# Altium schematic sheet MCU_block.SchDoc
size 420 x 297 mm; DocumentNumber: ЛАЭ3.20.10.02.05.200 Э3; SheetNumber: 2
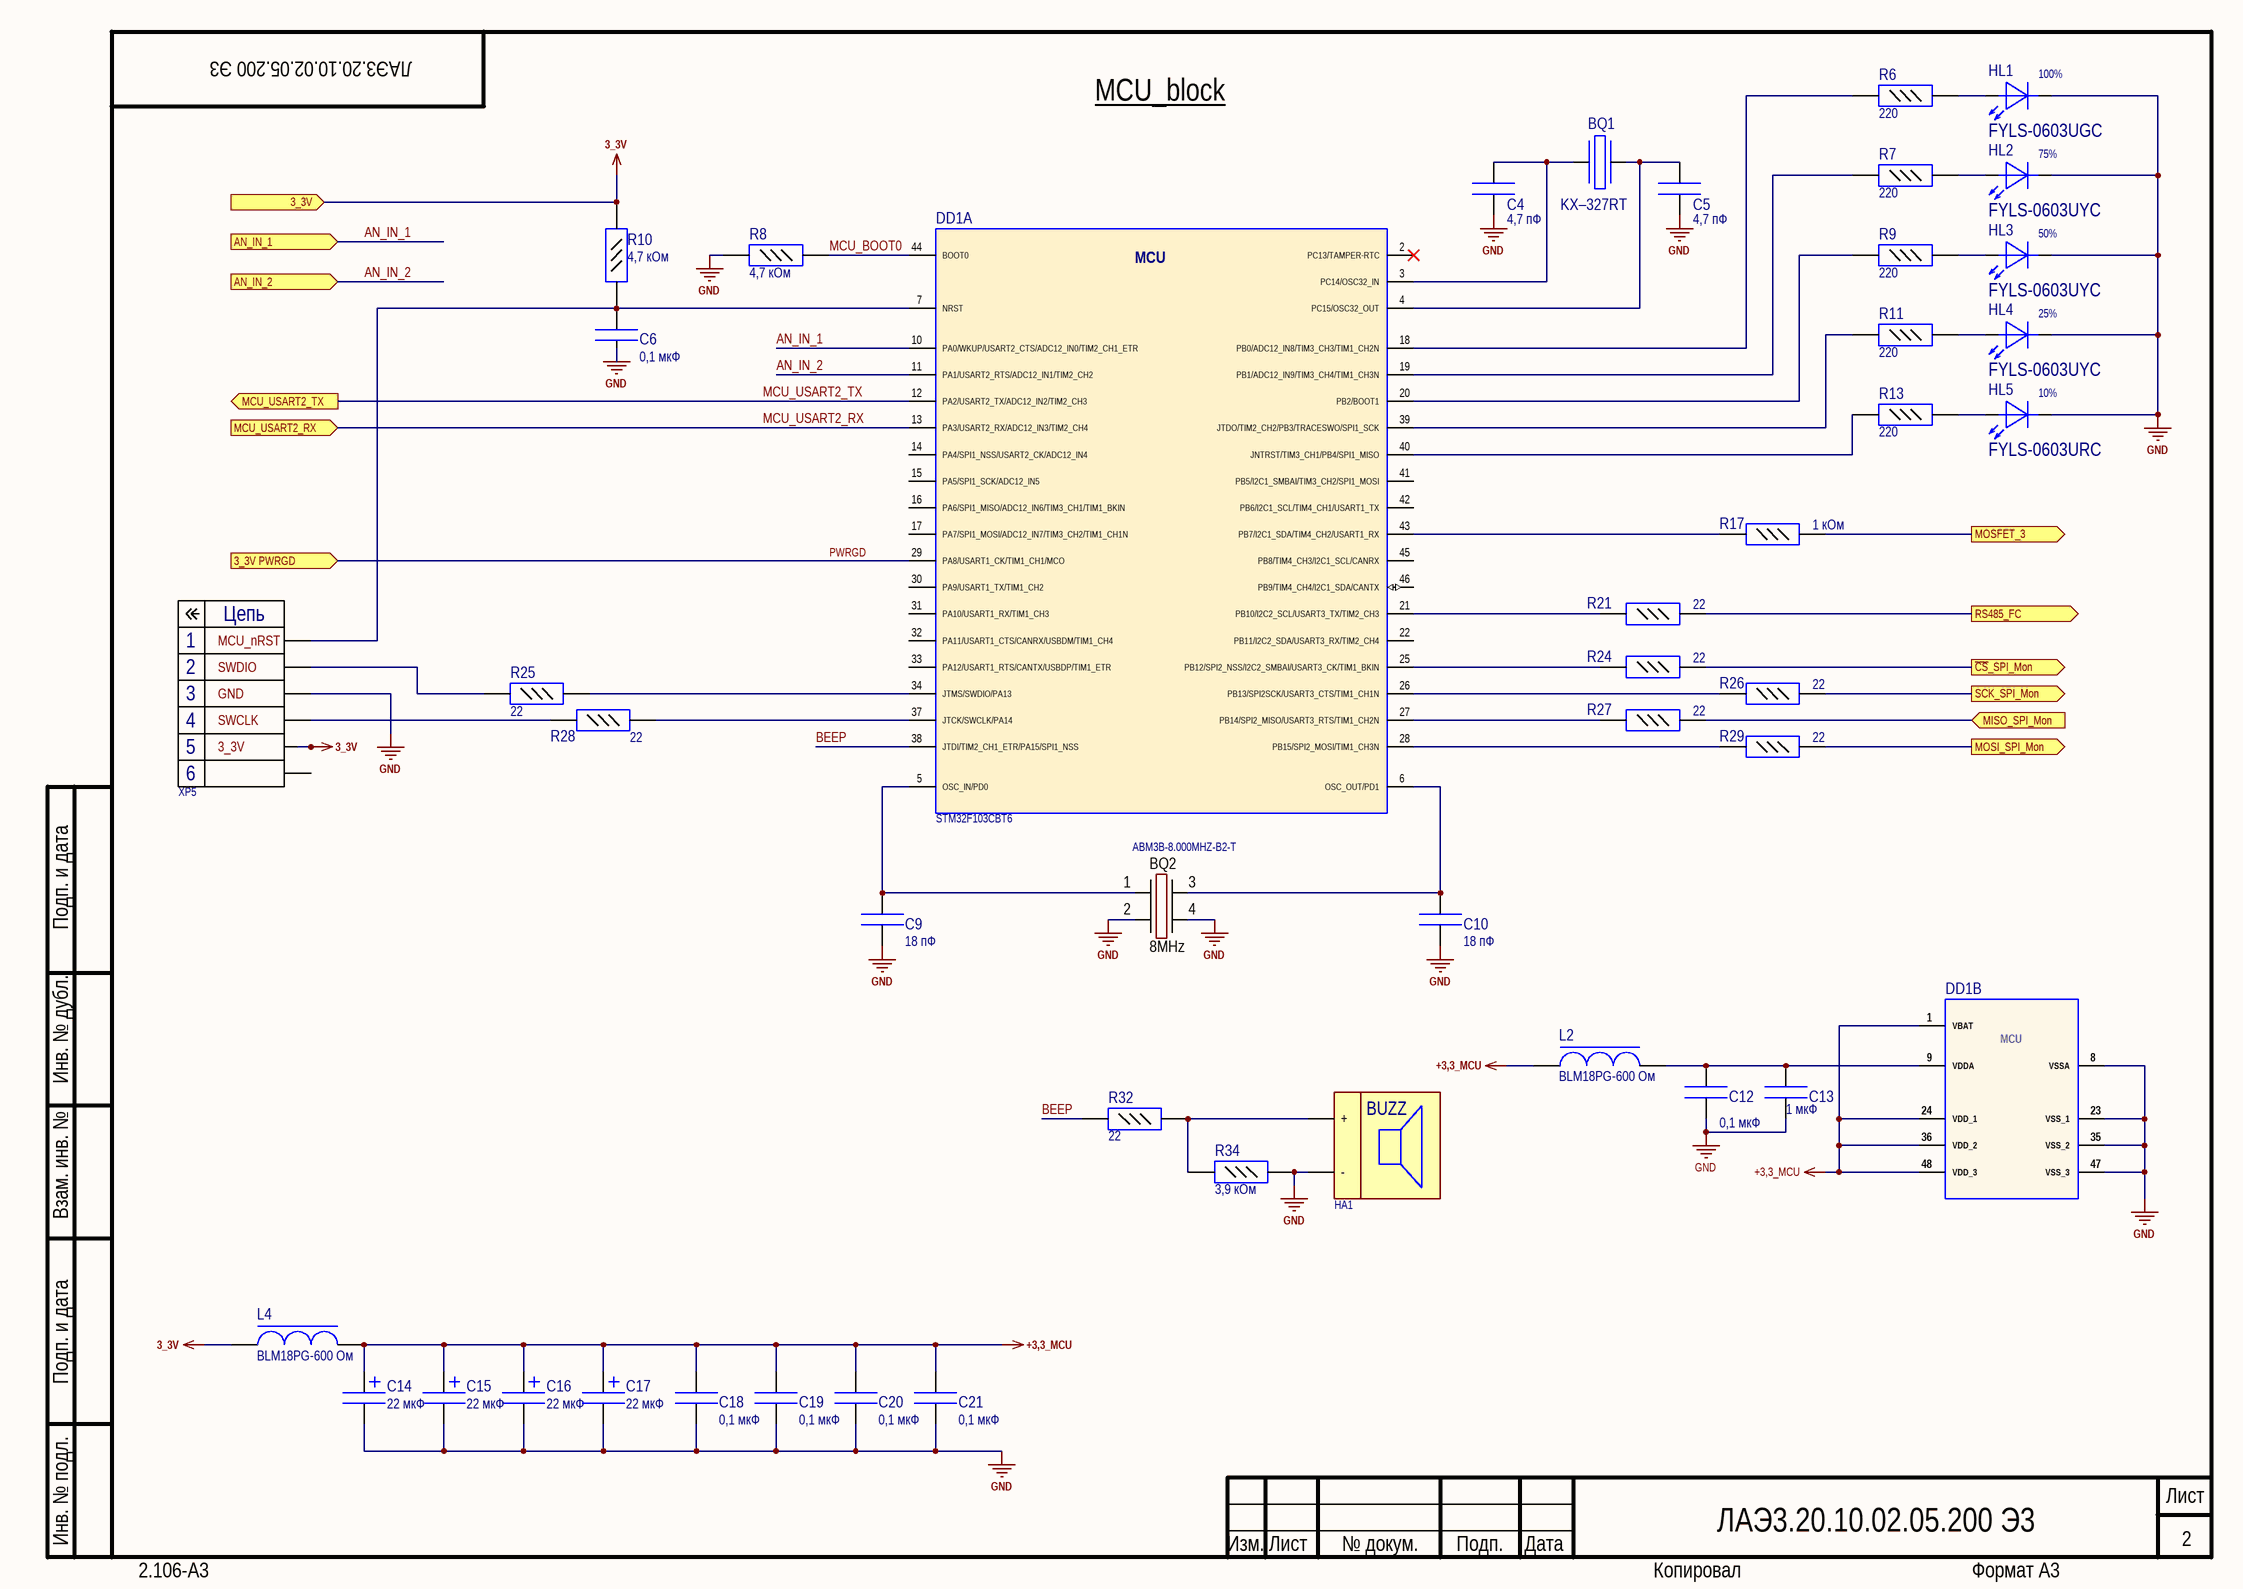
[diagram p0: MCU_block.SchDoc]

## Parts
BQ1  KX–327RT  [KX–327RT]
BQ2  Frequency: 8MHz  [OSC: 5032]  (hidden comment: ABM3B-8.000MHZ-B2-T)
C4  value 4,7 пФ  [CC0603]  (hidden comment: CC0603-X5R-4,7 пФ-20%-10В)
C5  value 4,7 пФ  [CC0603]  (hidden comment: CC0603-X5R-4,7 пФ-20%-10В)
C6  value 0,1 мкФ  [CC0603]  (hidden comment: CC0603-X5R-0,1 мкФ-20%-10В)
C9  value 18 пФ  [CC0603]  (hidden comment: CC0603-X5R-18 пФ-20%-10В)
C10  value 18 пФ  [CC0603]  (hidden comment: CC0603-X5R-18 пФ-20%-10В)
C12  value 0,1 мкФ  [CC0603]  (hidden comment: CC0603-X5R-0,1 мкФ-20%-10В)
C13  value 1 мкФ  [CC0603]  (hidden comment: CC0603-X5R-1 мкФ-20%-10В)
C14  value 22 мкФ  [CT-C]  (hidden comment: CT-10V-22uF-±20%-C)
C15  value 22 мкФ  [CT-C]  (hidden comment: CT-10V-22uF-±20%-C)
C16  value 22 мкФ  [CT-C]  (hidden comment: CT-10V-22uF-±20%-C)
C17  value 22 мкФ  [CT-C]  (hidden comment: CT-10V-22uF-±20%-C)
C18  value 0,1 мкФ  [CC0603]  (hidden comment: CC0603-X5R-0,1 мкФ-20%-10В)
C19  value 0,1 мкФ  [CC0603]  (hidden comment: CC0603-X5R-0,1 мкФ-20%-10В)
C20  value 0,1 мкФ  [CC0603]  (hidden comment: CC0603-X5R-0,1 мкФ-20%-10В)
C21  value 0,1 мкФ  [CC0603]  (hidden comment: CC0603-X5R-0,1 мкФ-20%-10В)
DD1  STM32F103CBT6  [LQFP50P700x700-48]  (parts A,B of 2)
HA1  HCM1203X  [HCM12X]  (value not drawn)
HL1  FYLS-0603UGC  mean: 100%  [LED0603_GREEN]
HL2  FYLS-0603UYC  mean: 75%  [LED0603_Yellow]
HL3  FYLS-0603UYC  mean: 50%  [LED0603_Yellow]
HL4  FYLS-0603UYC  mean: 25%  [LED0603_Yellow]
HL5  FYLS-0603URC  mean: 10%  [LED0603_Red]
L2  BLM18PG-600 Ом  [CL0603]
L4  BLM18PG-600 Ом  [CL0603]
R6  value 220  [CR0603]  (hidden comment: CR0603-220-±5%)
R7  value 220  [CR0603]  (hidden comment: CR0603-220-±5%)
R8  value 4,7 кОм  [CR0603]  (hidden comment: CR0603-4,7 кОм-±5%)
R9  value 220  [CR0603]  (hidden comment: CR0603-220-±5%)
R10  value 4,7 кОм  [CR0603]  (hidden comment: CR0603-4,7 кОм-±5%)
R11  value 220  [CR0603]  (hidden comment: CR0603-220-±5%)
R13  value 220  [CR0603]  (hidden comment: CR0603-220-±5%)
R17  value 1 кОм  [CR0603]  (hidden comment: CR0603-1 кОм-±5%)
R21  value 22  [CR0603]  (hidden comment: CR0603-22-±5%)
R24  value 22  [CR0603]  (hidden comment: CR0603-22-±5%)
R25  value 22  [CR0603]  (hidden comment: CR0603-22-±5%)
R26  value 22  [CR0603]  (hidden comment: CR0603-22-±5%)
R27  value 22  [CR0603]  (hidden comment: CR0603-22-±5%)
R28  value 22  [CR0603]  (hidden comment: CR0603-22-±5%)
R29  value 22  [CR0603]  (hidden comment: CR0603-22-±5%)
R32  value 22  [CR0603]  (hidden comment: CR0603-22-±5%)
R34  value 3,9 кОм  [CR0603]  (hidden comment: CR0603-3,9 кОм-±5%)
XP5  DS1022-1x6R  [PLS-6R]  (value not drawn)

## Ports
3_3V (in), 3_3V PWRGD (in), AN_IN_1 (in), AN_IN_2 (in), MCU_USART2_RX (in), MCU_USART2_TX (out), MISO_SPI_Mon (in), MOSFET_3 (out), MOSI_SPI_Mon (out), RS485_FC (out), SCK_SPI_Mon (out), ~{CS}_SPI_Mon (out)

## Nets
3_3V: L4.1 R10.2(-) XP5.5 ; port 3_3V
+3,3_MCU: C14.1(+) C15.1(+) C16.1(+) C17.1(+) C18.1(+) C19.1(+) C20.1(+) C21.1(+) DD1.1(VBAT) DD1.24(VDD_1) DD1.36(VDD_2) DD1.48(VDD_3) L2.1 L4.2
GND: BQ2.2 BQ2.4 C4.2(-) C5.2(-) C6.2(-) C9.2(-) C10.2(-) C12.2(-) C13.2(-) C14.2(-) C15.2(-) C16.2(-) C17.2(-) C18.2(-) C19.2(-) C20.2(-) C21.2(-) DD1.8(VSSA) DD1.23(VSS_1) DD1.35(VSS_2) DD1.47(VSS_3) HA1.2(-) HL1.2(K) HL2.2(K) HL3.2(K) HL4.2(K) HL5.2(K) R8.2(-) R34.1(+) XP5.3
AN_IN_1: DD1.10(PA0/WKUP/USART2_CTS/ADC12_IN0/TIM2_CH1_ETR) ; port AN_IN_1
AN_IN_2: DD1.11(PA1/USART2_RTS/ADC12_IN1/TIM2_CH2) ; port AN_IN_2
BEEP: DD1.38(JTDI/TIM2_CH1_ETR/PA15/SPI1_NSS) R32.1(+)
~{CS}_SPI_Mon: R24.2(-) ; port ~{CS}_SPI_Mon
MCU_BOOT0: DD1.44(BOOT0) R8.1(+)
MCU_USART2_RX: DD1.13(PA3/USART2_RX/ADC12_IN3/TIM2_CH4) ; port MCU_USART2_RX
MCU_USART2_TX: DD1.12(PA2/USART2_TX/ADC12_IN2/TIM2_CH3) ; port MCU_USART2_TX
MISO_SPI_Mon: R27.2(-) ; port MISO_SPI_Mon
MOSFET_3: R17.2(-) ; port MOSFET_3
MOSI_SPI_Mon: R29.2(-) ; port MOSI_SPI_Mon
PWRGD: DD1.29(PA8/USART1_CK/TIM1_CH1/MCO) ; port 3_3V PWRGD
RS485_FC: R21.2(-) ; port RS485_FC
SCK_SPI_Mon: R26.2(-) ; port SCK_SPI_Mon
NetBQ1_1: BQ1.1 C4.1(+) DD1.3(PC14/OSC32_IN)
NetBQ1_2: BQ1.2 C5.1(+) DD1.4(PC15/OSC32_OUT)
NetBQ2_1: BQ2.1 C9.1(+) DD1.5(OSC_IN/PD0)
NetBQ2_3: BQ2.3 C10.1(+) DD1.6(OSC_OUT/PD1)
NetC6_1: C6.1(+) DD1.7(NRST) R10.1(+) XP5.1
NetC12_1: C12.1(+) C13.1(+) DD1.9(VDDA) L2.2
NetDD1_18: DD1.18(PB0/ADC12_IN8/TIM3_CH3/TIM1_CH2N) R6.1(+)
NetDD1_19: DD1.19(PB1/ADC12_IN9/TIM3_CH4/TIM1_CH3N) R7.1(+)
NetDD1_20: DD1.20(PB2/BOOT1) R9.1(+)
NetDD1_21: DD1.21(PB10/I2C2_SCL/USART3_TX/TIM2_CH3) R21.1(+)
NetDD1_25: DD1.25(PB12/SPI2_NSS/I2C2_SMBAI/USART3_CK/TIM1_BKIN) R24.1(+)
NetDD1_26: DD1.26(PB13/SPI2SCK/USART3_CTS/TIM1_CH1N) R26.1(+)
NetDD1_27: DD1.27(PB14/SPI2_MISO/USART3_RTS/TIM1_CH2N) R27.1(+)
NetDD1_28: DD1.28(PB15/SPI2_MOSI/TIM1_CH3N) R29.1(+)
NetDD1_34: DD1.34(JTMS/SWDIO/PA13) R25.2(-)
NetDD1_37: DD1.37(JTCK/SWCLK/PA14) R28.2(-)
NetDD1_39: DD1.39(JTDO/TIM2_CH2/PB3/TRACESWO/SPI1_SCK) R11.1(+)
NetDD1_40: DD1.40(JNTRST/TIM3_CH1/PB4/SPI1_MISO) R13.1(+)
NetDD1_43: DD1.43(PB7/I2C1_SDA/TIM4_CH2/USART1_RX) R17.1(+)
NetHA1_1: HA1.1(+) R32.2(-) R34.2(-)
NetHL1_1: HL1.1(A) R6.2(-)
NetHL2_1: HL2.1(A) R7.2(-)
NetHL3_1: HL3.1(A) R9.2(-)
NetHL4_1: HL4.1(A) R11.2(-)
NetHL5_1: HL5.1(A) R13.2(-)
NetR25_1: R25.1(+) XP5.2
NetR28_1: R28.1(+) XP5.4

Not connected (* = marked no-connect by the designer): DD1 2(PC13/TAMPER-RTC)* 14(PA4/SPI1_NSS/USART2_CK/ADC12_IN4) 15(PA5/SPI1_SCK/ADC12_IN5) 16(PA6/SPI1_MISO/ADC12_IN6/TIM3_CH1/TIM1_BKIN) 17(PA7/SPI1_MOSI/ADC12_IN7/TIM3_CH2/TIM1_CH1N) 22(PB11/I2C2_SDA/USART3_RX/TIM2_CH4) 30(PA9/USART1_TX/TIM1_CH2) 31(PA10/USART1_RX/TIM1_CH3) 32(PA11/USART1_CTS/CANRX/USBDM/TIM1_CH4) 33(PA12/USART1_RTS/CANTX/USBDP/TIM1_ETR) 41(PB5/I2C1_SMBAI/TIM3_CH2/SPI1_MOSI) 42(PB6/I2C1_SCL/TIM4_CH1/USART1_TX) 45(PB8/TIM4_CH3/I2C1_SCL/CANRX) 46(PB9/TIM4_CH4/I2C1_SDA/CANTX); XP5 6

## Notes on the sheet
- MCU_block
- Labels drawn without touching a wire or pin: 3_3V, GND, MCU_nRST, SWCLK, SWDIO
- Подп. и дата
- Инв. № дубл.
- Взам. инв. №
- Инв. № подл.
- Изм.
- Лист
- № докум.
- Подп.
- Дата
- 2.106-A3
- Копировал
- Формат А3
- (in symbol HCM1203X) BUZZ
- (in symbol PLS-6R) Цепь
- (in symbol STM32F103CBT6, part A) MCU
- (in symbol STM32F103CBT6, part B) MCU

## Library data of the parts
BQ1 = KX–327RT: Чип резонатор 32.768 кГц
BQ2 = Crystal_5032: Manufacturer: Diodes Incorporated; PartNumber: FY1000009; ValueManufacturerPartNumber: Crystal, 8MHz, 20pF, ±30ppm, case 5032, -40...+85°C; LoadCapacitance: 20pF; Tolerance: ±30ppm; Package: case 5032; HelpURL: https://www.digikey.com/product-detail/en/diodes-incorporated/FY1000009/FY1000009CT-ND/6043911; Temperature: -40...+85°C; TypeOscilator: Crystal; Supplier 1: Avnet; Supplier Part Number 1: ABM3B-8.000MHZ-B2-T
C4-C6 C9 C10 C12 C13 C18-C21 = CC0603-X5R-#-20%-10В: Чип конденсатор керамический; Компэл: CC0603KRX5R6BB475; Supplier 1: Digi-Key; Supplier Part Number 1: 311-1455-2-ND
C14-C17 = CT-10V-#-±20%-C: Чип конденсатор  танталовый; PartNumber: 593D226X9016C2TE3
DD1 = STM32F103CBT6: Medium-density performance line ARM®-based 32-bit MCU with 64 / or 128 KB Flash, USB, CAN, 7 timers, 2 ADCs, 9 com. interfaces; ComponentLink1Description: Datasheet; ComponentLink1URL: https://www.st.com/resource/en/datasheet/stm32f103c8.pdf
HA1 = HCM1203X: Пьезокерамический излучатель звука
HL1 = FYLS-0603UGC: Светодиод зеленый SMD0603
HL2-HL4 = FYLS-0603UYC: Светодиод желтый SMD0603
HL5 = FYLS-0603URC: Светодиод красный SMD0603
L2 L4 = BLM18: Чип индуктивность подавления EMP; VALUE: 600 Ом; Supplier 1: Mouser; Supplier Part Number 1: 81-BLM18PG331SN1D
R6-R11 R13 R17 R21 R24-R29 R32 R34 = CR0603-#-±5%: Чип резистор
XP5 = PLS-6R: Штыри на плату однорядные угловые